# Altium schematic sheet TG21_TX_Xu ly ma tran phim.SchDoc
size A0; SheetNumber: 2; SheetTotal: 2
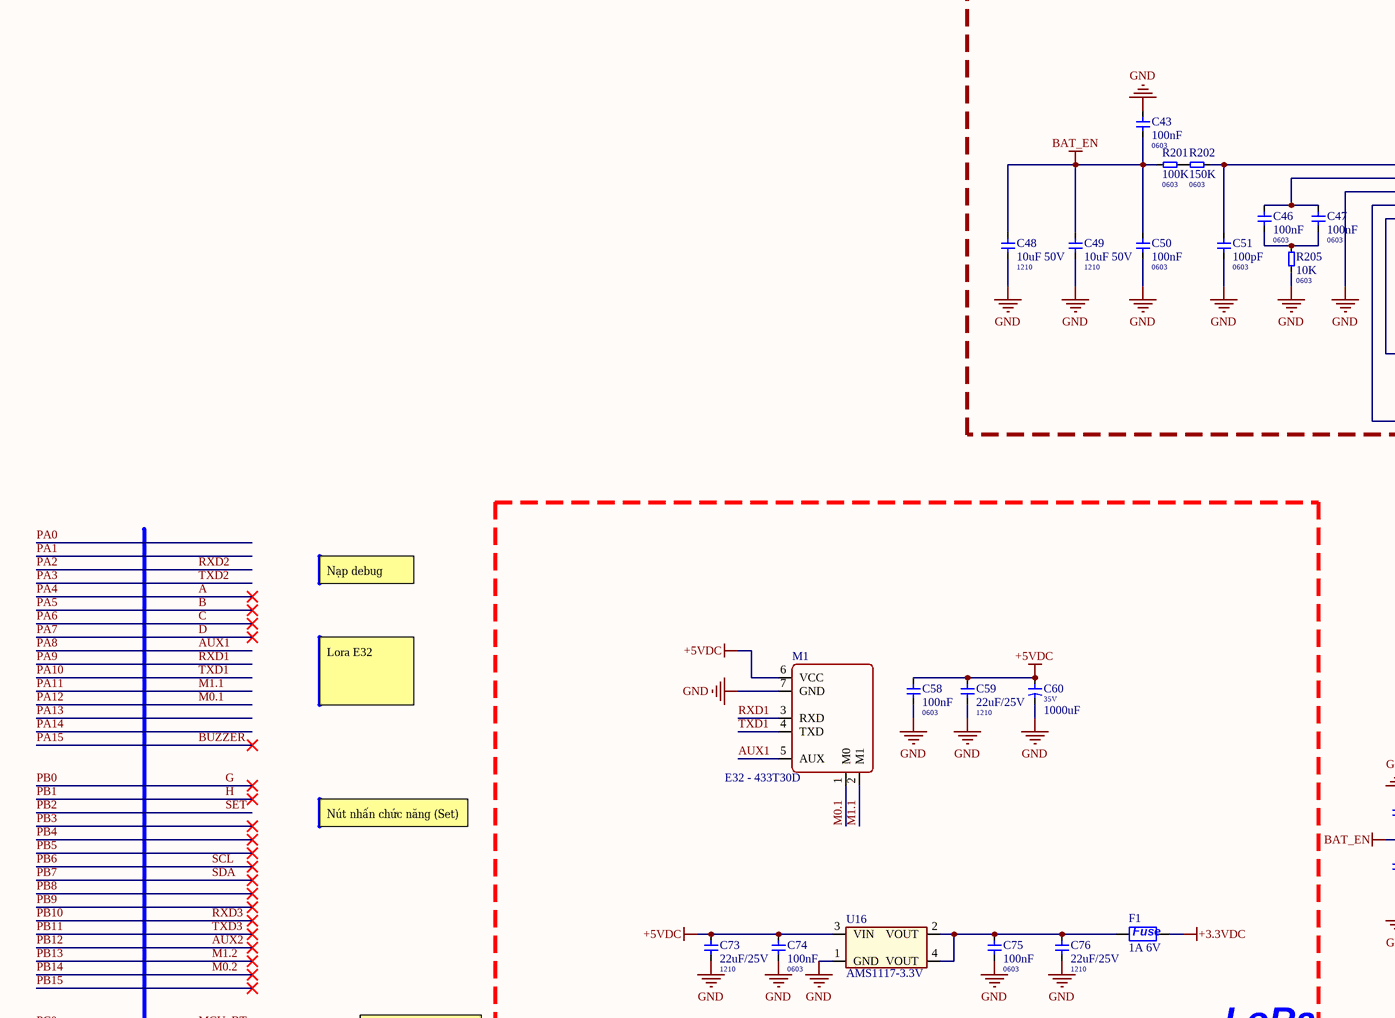
[diagram p0: TG21_TX_Xu ly ma tran phim.SchDoc, top left]
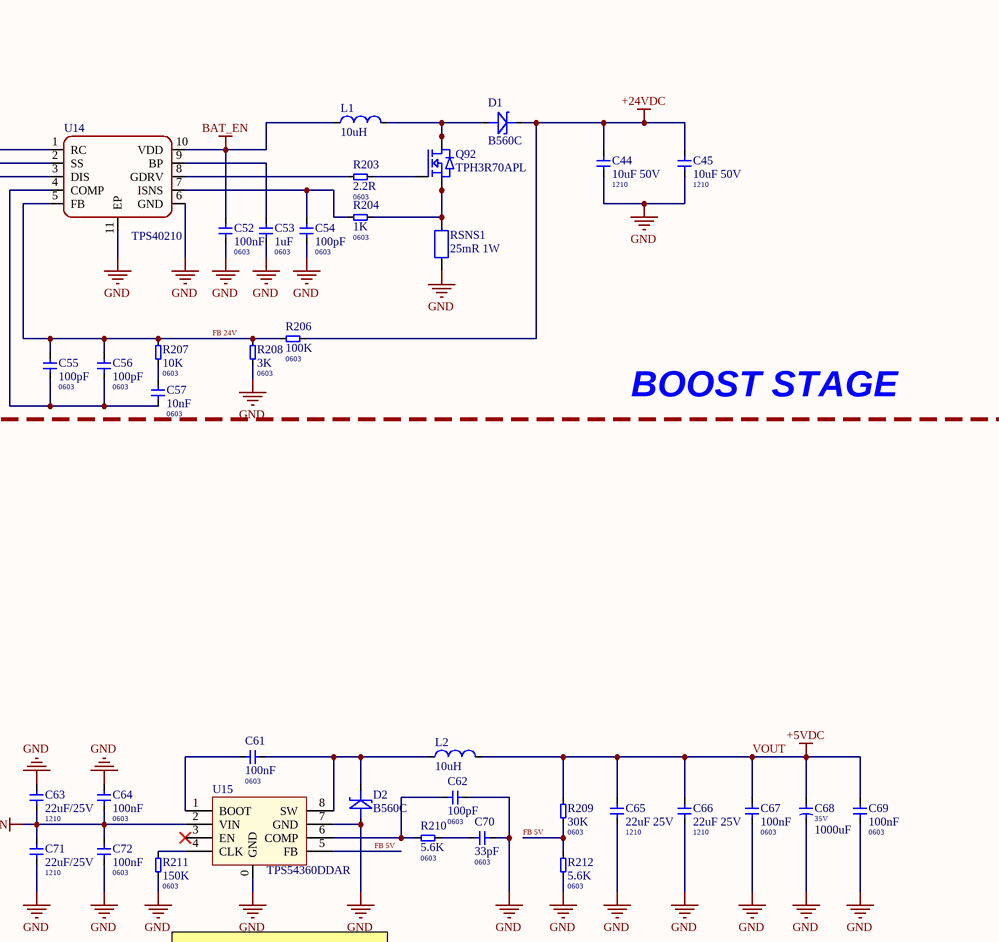
[diagram p1: TG21_TX_Xu ly ma tran phim.SchDoc, top right]
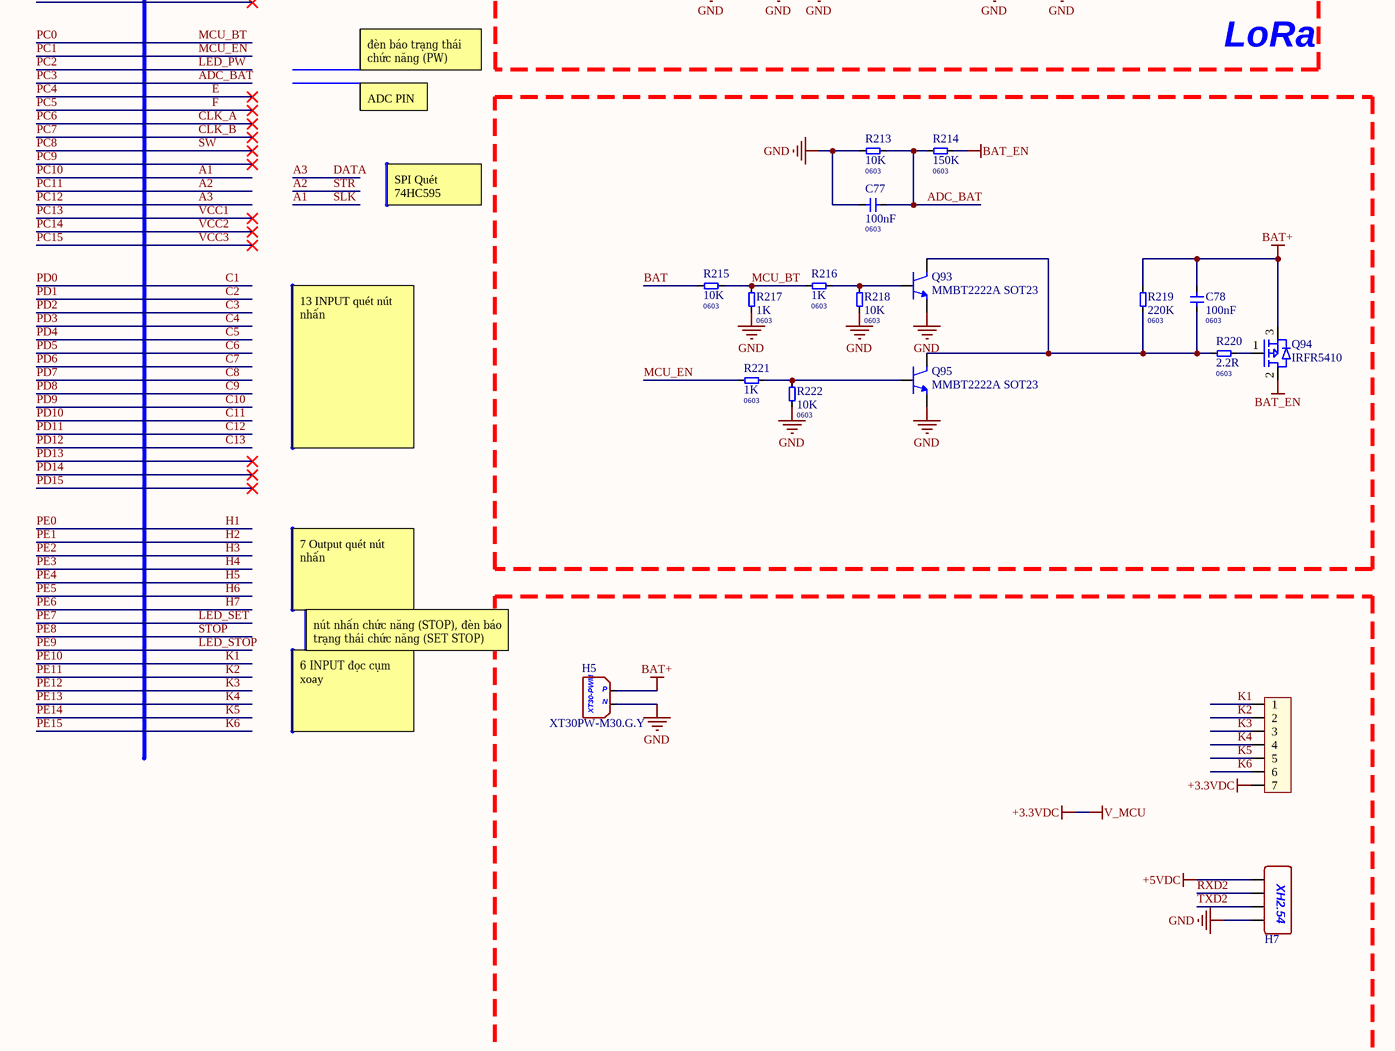
[diagram p2: TG21_TX_Xu ly ma tran phim.SchDoc, bottom left]
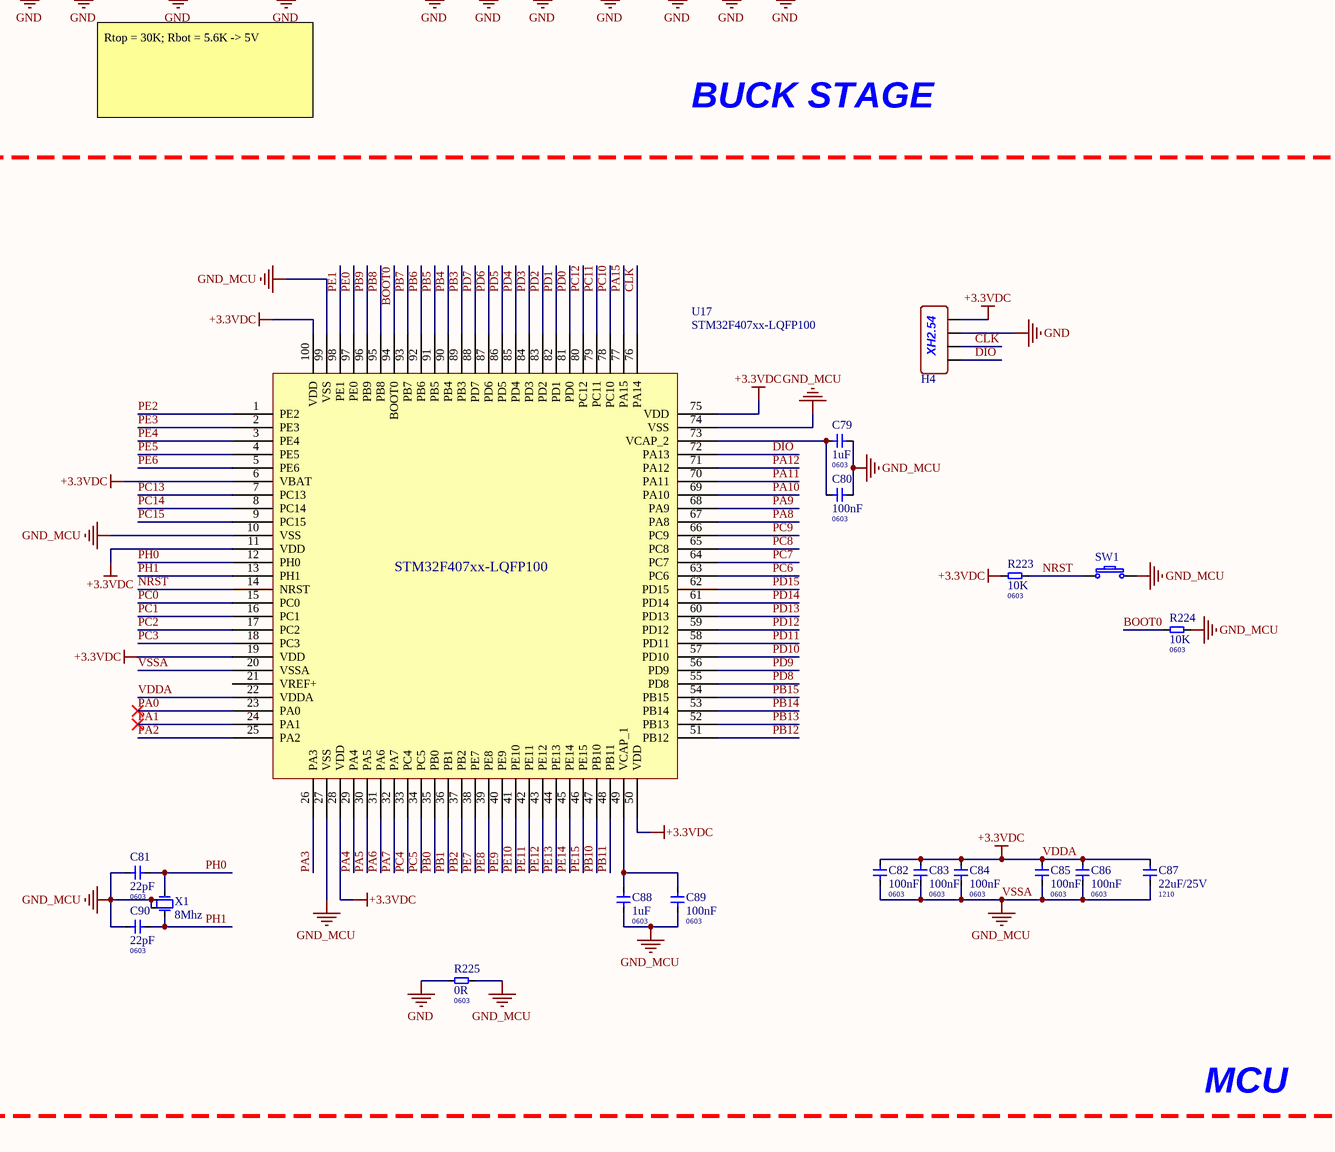
[diagram p3: TG21_TX_Xu ly ma tran phim.SchDoc, bottom right]

## Parts
C43  100nF  Package: 0603  [0603 MLCC]
C44  10uF 50V  Package: 1210  [1210 CAPACITOR]
C45  10uF 50V  Package: 1210  [1210 CAPACITOR]
C46  100nF  Package: 0603  [0603 MLCC]
C47  100nF  Package: 0603  [0603 MLCC]
C48  10uF 50V  Package: 1210  [1210 CAPACITOR]
C49  10uF 50V  Package: 1210  [1210 CAPACITOR]
C50  100nF  Package: 0603  [0603 MLCC]
C51  100pF  Package: 0603  [0603 MLCC]
C52  100nF  Package: 0603  [0603 MLCC]
C53  1uF  Package: 0603  [0603 MLCC]
C54  100pF  Package: 0603  [0603 MLCC]
C55  100pF  Package: 0603  [0603 MLCC]
C56  100pF  Package: 0603  [0603 MLCC]
C57  10nF  Package: 0603  [0603 MLCC]
C58  100nF  Package: 0603  [0603 MLCC]
C59  22uF/25V  Package: 1210  [1210 CAPACITOR]
C60  Voltage: 35V  Capacitor: 1000uF  [10x20 5.0 Capacitor]  (hidden comment: 1000uF/35V)
C61  100nF  Package: 0603  [0603 MLCC]
C62  100pF  Package: 0603  [0603 MLCC]
C63  22uF/25V  Package: 1210  [1210 CAPACITOR]
C64  100nF  Package: 0603  [0603 MLCC]
C65  22uF 25V  Package: 1210  [1210 CAPACITOR]
C66  22uF 25V  Package: 1210  [1210 CAPACITOR]
C67  100nF  Package: 0603  [0603 MLCC]
C68  Voltage: 35V  Capacitor: 1000uF  [10x20 5.0 Capacitor]  (hidden comment: 1000uF/35V)
C69  100nF  Package: 0603  [0603 MLCC]
C70  33pF  Package: 0603  [0603 MLCC]
C71  22uF/25V  Package: 1210  [1210 CAPACITOR]
C72  100nF  Package: 0603  [0603 MLCC]
C73  22uF/25V  Package: 1210  [1210 CAPACITOR]
C74  100nF  Package: 0603  [0603 MLCC]
C75  100nF  Package: 0603  [0603 MLCC]
C76  22uF/25V  Package: 1210  [1210 CAPACITOR]
C77  100nF  Package: 0603  [0603 MLCC]
C78  100nF  Package: 0603  [0603 MLCC]
C79  1uF  Package: 0603  [0603 MLCC]
C80  100nF  Package: 0603  [0603 MLCC]
C81  22pF  Package: 0603  [0603 MLCC]
C82  100nF  Package: 0603  [0603 MLCC]
C83  100nF  Package: 0603  [0603 MLCC]
C84  100nF  Package: 0603  [0603 MLCC]
C85  100nF  Package: 0603  [0603 MLCC]
C86  100nF  Package: 0603  [0603 MLCC]
C87  22uF/25V  Package: 1210  [1210 CAPACITOR]
C88  1uF  Package: 0603  [0603 MLCC]
C89  100nF  Package: 0603  [0603 MLCC]
C90  22pF  Package: 0603  [0603 MLCC]
D1  B560C  [SMC(DO-214AB)]
D2  B560C  [SMC(DO-214AB)]
F1  1A 6V  [1206 - Fuse]
H4  XY-XH2.54-4PZZ  [XH2.54 - 4PZZ]  (value not drawn)
H5  XT30PW-M30.G.Y  [XT30]
H6  Header 7P 2.54 Duc Thang  [XH2.54M-7]  (value not drawn)
H7  XY-XH2.54-4PZZ  [XH2.54 - 4PZZ]  (value not drawn)
L1  10uH  [12.2x12.2mm]
L2  10uH  [12.2x12.2mm]
M1  E32 - 433T30D  [E32 - 433T30D]
Q92  TPH3R70APL  [SOP Advanced]
Q93  MMBT2222A SOT23  [SOT23_HVT]
Q94  IRFR5410  [TO - 252]
Q95  MMBT2222A SOT23  [SOT23_HVT]
R201  100K  Package: 0603  [0603 Resistors]
R202  150K  Package: 0603  [0603 Resistors]
R203  2.2R  Package: 0603  [0603 Resistors]
R204  1K  Package: 0603  [0603 Resistors]
R205  10K  Package: 0603  [0603 Resistors]
R206  100K  Package: 0603  [0603 Resistors]
R207  10K  Package: 0603  [0603 Resistors]
R208  3K  Package: 0603  [0603 Resistors]
R209  30K  Package: 0603  [0603 Resistors]
R210  5.6K  Package: 0603  [0603 Resistors]
R211  150K  Package: 0603  [0603 Resistors]
R212  5.6K  Package: 0603  [0603 Resistors]
R213  10K  Package: 0603  [0603 Resistors]
R214  150K  Package: 0603  [0603 Resistors]
R215  10K  Package: 0603  [0603 Resistors]
R216  1K  Package: 0603  [0603 Resistors]
R217  1K  Package: 0603  [0603 Resistors]
R218  10K  Package: 0603  [0603 Resistors]
R219  220K  Package: 0603  [0603 Resistors]
R220  2.2R  Package: 0603  [0603 Resistors]
R221  1K  Package: 0603  [0603 Resistors]
R222  10K  Package: 0603  [0603 Resistors]
R223  10K  Package: 0603  [0603 Resistors]
R224  10K  Package: 0603  [0603 Resistors]
R225  0R  Package: 0603  [0603 Resistors]
RSNS1  25mR 1W  [1206 Resistor]
SW1  HX 3x6x2.5A-2.5N  [SW - 2P SMD]  (value not drawn)
U14  TPS40210  [MSOP 10]
U15  TPS54360DDAR  [SOIC8]
U16  AMS1117-3.3V  [SOT223 - 4P]
U17  STM32F407xx-LQFP100  [STM32_LQFP100]
X1  8Mhz  [5032 4P]

## Blocks framed on the sheet
BOOST STAGE: C43-C57 D1 L1 Q92 R201-R208 RSNS1 U14
LoRa: C58-C60 C73-C76 F1 M1 U16
MCU: C79-C90 H4 R223-R225 SW1 U17 X1

## Nets
+24VDC: C44.2 C45.2 D1.2(Kathode) R206.2
BAT+: C78.2 H5.1 Q94.3(S) R219.2
BAT_EN: C43.1 C48.2 C49.2 C50.1 C52.2 C63.1 C64.1 C71.1 C72.2 L1.1 Q94.2(D) R201.1 R214.2 U14.10(VDD) U15.2(VIN)
GND: C43.2 C44.1 C45.1 C48.1 C49.1 C50.2 C51.1 C52.1 C53.2 C54.1 C58.1 C59.1 C60.2 C62.1 C63.2 C64.2 C65.1 C66.1 C67.1 C68.2 C69.1 C70.1 C71.2 C72.1 C73.2 C74.1 C75.1 C76.2 C77.2 D2.1(Anode) H4.2 H5.2 H7.1 M1.7(GND) Q93.2(E) Q95.2(E) R205.1 R208.1 R211.1 R212.1 R213.2 R217.1 R218.1 R222.1 R225.1 RSNS1.1 U14.3(DIS) U14.6(GND) U14.11(EP) U15.0(GND) U15.7(GND) U16.1(GND)
VDDA: C82.2 C83.2 C84.2 C85.2 C86.2 C87.1 F1.2 H4.1 H6.7 R223.1 U17.6(VBAT) U17.11(VDD) U17.19(VDD) U17.22(VDDA) U17.28(VDD) U17.50(VDD) U17.75(VDD) U17.100(VDD)  [also labelled +3.3VDC, V_MCU]
VOUT: C58.2 C59.2 C60.1 C65.2 C66.2 C67.2 C68.1 C69.2 C73.1 C74.2 H7.4 L2.2 M1.6(VCC) R209.2 U16.3(VIN)  [also labelled +5VDC]
VSSA: C79.1 C80.1 C81.2 C82.1 C83.1 C84.1 C85.1 C86.1 C87.2 C88.1 C89.1 C90.2 R224.1 R225.2 SW1.2 U17.10(VSS) U17.20(VSSA) U17.27(VSS) U17.74(VSS) U17.99(VSS) X1.2 X1.4  [also labelled GND_MCU]
A: U17.29(PA4)  [also labelled PA4]
A1: U17.78(PC10)  [also labelled PC10, SLK]
A2: U17.79(PC11)  [also labelled PC11, STR]
A3: U17.80(PC12)  [also labelled DATA, PC12]
ADC_BAT: C77.1 R213.1 R214.1 U17.18(PC3)  [also labelled PC3]
AUX1: M1.5(AUX) U17.67(PA8)  [also labelled PA8]
AUX2: U17.51(PB12)  [also labelled PB12]
B: U17.30(PA5)  [also labelled PA5]
BAT: R215.1
BOOT0: R224.2 U17.94(BOOT0)
BUZZER: U17.77(PA15)  [also labelled PA15]
C: U17.31(PA6)  [also labelled PA6]
C1: U17.81(PD0)  [also labelled PD0]
C2: U17.82(PD1)  [also labelled PD1]
C3: U17.83(PD2)  [also labelled PD2]
C4: U17.84(PD3)  [also labelled PD3]
C5: U17.85(PD4)  [also labelled PD4]
C6: U17.86(PD5)  [also labelled PD5]
C7: U17.87(PD6)  [also labelled PD6]
C8: U17.88(PD7)  [also labelled PD7]
C9: U17.55(PD8)  [also labelled PD8]
C10: U17.56(PD9)  [also labelled PD9]
C11: U17.57(PD10)  [also labelled PD10]
C12: U17.58(PD11)  [also labelled PD11]
C13: U17.59(PD12)  [also labelled PD12]
CLK: H4.3 U17.76(PA14)
CLK_A: U17.63(PC6)  [also labelled PC6]
CLK_B: U17.64(PC7)  [also labelled PC7]
D: U17.32(PA7)  [also labelled PA7]
DIO: H4.4 U17.72(PA13)
E: U17.33(PC4)  [also labelled PC4]
F: U17.34(PC5)  [also labelled PC5]
FB 5V: R209.1 R212.2 U15.5(FB)
FB 24V: C55.2 C56.2 R206.1 R207.2 R208.2 U14.5(FB)
G: U17.35(PB0)  [also labelled PB0]
H: U17.36(PB1)  [also labelled PB1]
H1: U17.97(PE0)  [also labelled PE0]
H2: U17.98(PE1)  [also labelled PE1]
H3: U17.1(PE2)  [also labelled PE2]
H4: U17.2(PE3)  [also labelled PE3]
H5: U17.3(PE4)  [also labelled PE4]
H6: U17.4(PE5)  [also labelled PE5]
H7: U17.5(PE6)  [also labelled PE6]
K1: H6.1 U17.41(PE10)  [also labelled PE10]
K2: H6.2 U17.42(PE11)  [also labelled PE11]
K3: H6.3 U17.43(PE12)  [also labelled PE12]
K4: H6.4 U17.44(PE13)  [also labelled PE13]
K5: H6.5 U17.45(PE14)  [also labelled PE14]
K6: H6.6 U17.46(PE15)  [also labelled PE15]
LED_PW: U17.17(PC2)  [also labelled PC2]
LED_SET: U17.38(PE7)  [also labelled PE7]
LED_STOP: U17.40(PE9)  [also labelled PE9]
M0.1: M1.1(M0) U17.71(PA12)  [also labelled PA12]
M0.2: U17.53(PB14)  [also labelled PB14]
M1.1: M1.2(M1) U17.70(PA11)  [also labelled PA11]
M1.2: U17.52(PB13)  [also labelled PB13]
MCU_BT: R215.2 R216.2 R217.2 U17.15(PC0)  [also labelled PC0]
MCU_EN: R221.2 U17.16(PC1)  [also labelled PC1]
NRST: R223.2 SW1.1 U17.14(NRST)
PA0: U17.23(PA0)
PA1: U17.24(PA1)
PA2: H7.3 U17.25(PA2)  [also labelled RXD2]
PA3: H7.2 U17.26(PA3)  [also labelled TXD2]
PA9: M1.3(RXD) U17.68(PA9)  [also labelled RXD1]
PA10: M1.4(TXD) U17.69(PA10)  [also labelled TXD1]
PB2: U17.37(PB2)  [also labelled SET]
PB3: U17.89(PB3)
PB4: U17.90(PB4)
PB5: U17.91(PB5)
PB6: U17.92(PB6)  [also labelled SCL]
PB7: U17.93(PB7)  [also labelled SDA]
PB8: U17.95(PB8)
PB9: U17.96(PB9)
PB10: U17.47(PB10)  [also labelled RXD3]
PB11: U17.48(PB11)  [also labelled TXD3]
PB15: U17.54(PB15)
PC8: U17.65(PC8)  [also labelled SW]
PC9: U17.66(PC9)
PC13: U17.7(PC13)  [also labelled VCC1]
PC14: U17.8(PC14)  [also labelled VCC2]
PC15: U17.9(PC15)  [also labelled VCC3]
PD13: U17.60(PD13)
PD14: U17.61(PD14)
PD15: U17.62(PD15)
PE8: U17.39(PE8)  [also labelled STOP]
PH0: C81.1 U17.12(PH0) X1.3
PH1: C90.1 U17.13(PH1) X1.1
NetC46_1: C46.1 C47.1 U14.2(SS)
NetC46_2: C46.2 C47.2 R205.2
NetC51_2: C51.2 R202.2 U14.1(RC)
NetC53_1: C53.1 U14.9(BP)
NetC54_2: C54.2 R204.1 U14.7(ISNS)
NetC55_1: C55.1 C56.1 C57.1 U14.4(COMP)
NetC57_2: C57.2 R207.1
NetC61_1: C61.1 D2.2(Kathode) L2.1 U15.8(SW)
NetC61_2: C61.2 U15.1(BOOT)
NetC62_2: C62.2 R210.1 U15.6(COMP)
NetC70_2: C70.2 R210.2
NetC75_2: C75.2 C76.1 F1.1 U16.2(VOUT) U16.4(VOUT)
NetC78_1: C78.1 Q93.3(C) Q95.3(C) R219.1 R220.2
NetC79_2: C79.2 C80.2 U17.73(VCAP_2)
NetC88_2: C88.2 C89.2 U17.49(VCAP_1)
NetD1_1: D1.1(Anode) L1.2 Q92.5(D) Q92.6(D) Q92.7(D) Q92.8(D) Q92.TAB(D)
NetQ92_1: Q92.1(S) Q92.2(S) Q92.3(S) R204.2 RSNS1.2
NetQ92_4: Q92.4(G) R203.2
NetQ93_1: Q93.1(B) R216.1 R218.2
NetQ94_1: Q94.1(G) R220.1
NetQ95_1: Q95.1(B) R221.1 R222.2
NetR201_2: R201.2 R202.1
NetR203_1: R203.1 U14.8(GDRV)
NetR211_2: R211.2 U15.4(CLK)

Not connected (* = marked no-connect by the designer): U15 3(EN)*; U17 21(VREF+)

## Notes on the sheet
- Nạp debug
- Lora E32
- Nút nhấn chức năng (Set)
- đèn báo trạng thái chức năng (PW)
- Rtop = 30K; Rbot = 5.6K -> 5V
- BUCK STAGE
- ADC PIN
- SPI Quét 74HC595
- 13 INPUT quét nút nhấn
- 7 Output quét nút nhấn
- nút nhấn chức năng (STOP), đèn báo trạng thái chức năng (SET STOP)
- 6 INPUT đọc cụm xoay
- (in symbol XH2.54 4PZZ) XH2.54
- (in symbol XT30PW-M30.G.Y) P; N; XT30-PWM

## Library data of the parts
C43 C46 C47 C50 C52 C58 C61 C64 C67 C69 C72 C74 C75 C77 C78 C80 C82-C86 C89 = 0603 100nF: 100nF ±10% 50V Ceramic Capacitor X7R 0603; Manufacturer: YAGEO; Mfr. Part #: CC0603KRX7R9BB104; LCSC Part #: C14663; ComponentLink1Description: LCSC Link; ComponentLink1URL: https://www.lcsc.com/product-detail/C14663.html?s_z=n_0603%2520100nF
C44 C45 C48 C49 = 1210 10uF 50V: 10uF ±10% 50V Ceramic Capacitor X7R 1210; Manufacturer: Samsung Electro-Mechanics; Mfr. Part #: CL32B106KBJNNNE; LCSC Part #: C138687; ComponentLink1Description: LCSC Link; ComponentLink1URL: https://www.lcsc.com/product-detail/C138687.html?s_z=n_1210%252010uF
C51 C54-C56 C62 = 0603 100pF: 100pF ±5% 50V Ceramic Capacitor C0G 0603; Manufacturer: Samsung Electro-Mechanics; Mfr. Part #: CL10C101JB8NNNC; LCSC Part #: C14858; ComponentLink1Description: LCSC Link; ComponentLink1URL: https://www.lcsc.com/product-detail/C14858.html?s_z=n_100pF%25200603&spm=wm.ssy.bg.0.xh&lcsc_vid=FVcIBVBRElIPBFdUFgBYX10HEQJbUQVVQANfV1wFQQcxVlNRQ1RWV1NSQ1dXXjsOAxUeFF5JWBYZEEoKFBINSQcJGk4eFQsCAgIaSgADAwAHC0slRVheUFRSQU8GEwkK
C53 C79 C88 = 0603 1uF: 1uF ±10% 50V Ceramic Capacitor X5R 0603; Manufacturer: Samsung Electro-Mechanics; Mfr. Part #: CL10A105KB8NNNC; LCSC Part #: C15849; ComponentLink1Description: LCSC Link; ComponentLink1URL: https://www.lcsc.com/product-detail/C15849.html?s_z=n_1uF%25200603%25201%2525&spm=wm.ssy.bg.0.xh&lcsc_vid=FVcIBVBRElIPBFdUFgBYX10HEQJbUQVVQANfV1wFQQcxVlNRQlFeXlNXT1hdUDsOAxUeFF5JWBYZEEoKFBINSQcJGk4%3D
C57 = 0603 10nF: 10nF ±10% 50V Ceramic Capacitor X7R 0603; Manufacturer: YAGEO; Mfr. Part #: CC0603KRX7R9BB103; LCSC Part #: C100042; ComponentLink1Description: LCSC Link; ComponentLink1URL: https://www.lcsc.com/product-detail/C100042.html?s_z=n_0603%252010nF&spm=wm.ssy.bg.0.xh&lcsc_vid=FVcIBVBRElIPBFdUFgBYX10HEQJbUQVVQANfV1wFQQcxVlNRQlFfVVBSRVNYXjsOAxUeFF5JWBYZEEoKFBINSQcJGk4eFQsCAgIaSgADAwAHC0slRFFaV1JQWQkaCgg%3D
C59 C63 C71 C73 C76 C87 = 1210 22uF 25V X7R: 22uF ±10% 25V Ceramic Capacitor X7R 1210; Manufacturer: Samsung Electro-Mechanics; Mfr. Part #: CL32B226KAJNNNE; LCSC Part #: C309062; ComponentLink1Description: LCSC Link; ComponentLink1URL: https://www.lcsc.com/product-detail/C309062.html?s_z=n_22uF%25201210
C60 C68 = 10x20 1000uF 35V: 1000uF 35V Aluminum Electrolytic Capacitors Through Hole,D10xL20mm 2000hrs@105℃; Manufacturer: Rubycon; Mfr. Part #: 35PX1000MEFC10X20; LCSC Part #: C136014; ComponentLink1Description: LCSC Link; ComponentLink1URL: https://www.lcsc.com/product-detail/C136014.html?s_z=n_35V%25201000uF%2520rubycon; Package: Through Hole,D10xL20mm; Type: Capacitor; Assembly Type: DIP Assembly
C65 C66 = 1210 22uF 25V: 22uF ±10% 25V Ceramic Capacitor X7R 1210; Manufacturer: Samsung Electro-Mechanics; Mfr. Part #: CL32B226KAJNNNE; LCSC Part #: C309062; ComponentLink1Description: LCSC Link; ComponentLink1URL: https://www.lcsc.com/product-detail/C309062.html?s_z=n_22uF%25201210
C70 = 0603 33pF: 33pF ±5% 50V Ceramic Capacitor NP0 0603; Manufacturer: YAGEO; Mfr. Part #: CC0603JRNPO9BN330; LCSC Part #: C107047; ComponentLink1Description: LCSC Link; ComponentLink1URL: https://www.lcsc.com/product-detail/C107047.html?s_z=n_33pF%25200603&spm=wm.ssy.bg.0.xh&lcsc_vid=FVcIBVBRElIPBFdUFgBYX10HEQJbUQVVQANfV1wFQQcxVlNRQ1RWV1xeR1ZZUTsOAxUeFF5JWBYZEEoKFBINSQcJGk4dAgUUFAk%3D
C81 C90 = 0603 22pF: 22pF ±5% 50V Ceramic Capacitor C0G 0603; Manufacturer: Samsung Electro-Mechanics; Mfr. Part #: CL10C220JB8NNNC; LCSC Part #: C1653; ComponentLink1Description: LCSC Link; ComponentLink1URL: https://www.lcsc.com/product-detail/C1653.html?s_z=n_22pF%252050V%25200603
D1 D2 = B560C - 13- F: Voltage： 60V Current： 5A; Manufacturer: DIODES; Mfr. Part #: B560C-13-F; LCSC Part #: C85100; Package: SMC(DO-214AB); ComponentLink1Description: LCSC Link; ComponentLink1URL: https://www.lcsc.com/product-detail/C85100.html?s_z=n_B560C
F1 = 1206 Fuse 1A 6V: Polymeric PTC Resettable Fuse 6V 1A Surface Mount 1206; Manufacturer: BHFUSE; Mfr. Part #: BSMD1206-100-6V; LCSC Part #: C883129; Package: 1206; ComponentLink1Description: LCSC Link; ComponentLink1URL: https://www.lcsc.com/product-detail/C883129.html?s_z=n_q_Resettable%2520Fuse%25206V%25201A%25201206&spm=wm.fly.bg.0.xh&lcsc_vid=QQBdBlYAQFFWUgBXTlUPAgFQQQIIBQIHEQIPAgJRQFAxVlNRT1daVVdeT1JfUzsOAxUeFF5JWBYZEEoKFBINSQcJGk4NBhADEA4cHktXRVZADxALGw%3D%3D; ComponentLink2Description: Datasheet; ComponentLink2URL: NO; Type: Fuse; Assembly Type: SMT Assembly
H4 H7 = XH2.54 4PZZ: XH 1 4P -25℃~+85℃ 2.54mm 4 2A 250V 1x4P Through Hole,P=2.54mm Headers, Male Pins RoHS; Manufacturer: XYECONN; Mfr. Part #: XY-XH2.54-4PZZ; LCSC Part #: C53201003; ComponentLink1Description: LCSC Link; ComponentLink1URL: https://www.lcsc.com/product-detail/C53201003.html?s_z=n_XH2.54%25204P; Package: Through Hole,P=2.54mm; Type: Header; Assembly Type: DIP Assembly; ComponentLink2Description: Datasheet; ComponentLink2URL: https://www.lcsc.com/datasheet/C53201003.pdf
H5 = XT30PW-M30.G.Y: AMASS XT30PW-M30.G.Y; Manufacturer: Changzhou Amass Elec; Mfr. Part #: XT30PW-M30.G.Y; LCSC Part #: C431092; ComponentLink1Description: LCSC Link; ComponentLink1URL: https://www.lcsc.com/product-detail/C431092.html?s_z=n_q_xt30pw&spm=wm.fly.bg.0.xh&lcsc_vid=QQBdBlYAQFFWUgBXTlUPAgFQQQIIBQIHEQIPAgJRQFAxVlNRT1ddX1xWQlNaUzsOAxUeFF5JWBYZEEoKFBINSQcJGk4eFQsCAgIaSgADAwAHC0slQllfX11TQk8GEwkK; ComponentLink2Description: Datasheet; ComponentLink2URL: https://www.lcsc.com/datasheet/C431092.pdf?spm=wm.sxq.inf.ggs___wm.fly.bg.0.xh&lcsc_vid=QQBdBlYAQFFWUgBXTlUPAgFQQQIIBQIHEQIPAgJRQFAxVlNRT1ddX1xWQlNaUzsOAxUeFF5JWBYZEEoKFBINSQcJGk4eFQsCAgIaSgADAwAHC0slQllfX11TQk8GEwkK; Type: Connector/Header; Assembly Type: DIP Assembly; Value: XT30PW-M30.G.Y
H6 = Header 7P 2.54 Duc Thang: Cắm; Ten_Linh_Kien: Header 7P XH2.54-7P Đực Thẳng; Don_Vi: Con; Ma_Hang: MH003369; Chung_Loai: Cắm
L1 L2 = CDRH127N 10uH: 5.4A 10uH 21.6mΩ ±20% SMD,12.2x12.2mm Fixed Inductors RoHS; Manufacturer: MINGSTAR; Mfr. Part #: CDRH127N-100M; LCSC Part #: C2832085; Package: SMD,12.2x12.2mm; ComponentLink1Description: LCSC Link; ComponentLink1URL: http://lcsc.com/product-detail/C2832085.html?s_z=n_CDRH127
M1 = E32 - 433T30D: 8km UART Through Hole RF Transceiver Modules and Modems RoHS; Manufacturer: EBYTE; Mfr. Part #: E32-433T30D; LCSC Part #: C97351; Package: Through Hole; Type: Module; ComponentLink1Description: LCSC Link; ComponentLink1URL: https://www.lcsc.com/product-detail/C97351.html?s_z=n_E32%2520433T30D; ComponentLink2Description: Datasheet; ComponentLink2URL: https://www.lcsc.com/datasheet/C97351.pdf
Q92 = TPH3R70: Manufacturer: TOSHIBA; Mfr. Part #: TPH3R70APL; LCSC Part #: C556308; Package: SO-8; ComponentLink1Description: LCSC Link; ComponentLink1URL: https://www.lcsc.com/product-detail/C556308.html?s_z=n_tph3R70
Q93 Q95 = MMBT2222A: Bipolar (BJT) Transistor NPN 20V 350mA 300MHz 300mW Surface Mount SOT-23; Manufacturer: JSMSEMI; Mfr. Part #: MMBT2222A; LCSC Part #: C916372; Package: SOT-23; ComponentLink1Description: LCSC Link; ComponentLink1URL: https://www.lcsc.com/product-detail/C916372.html?s_z=n_mmbt222&spm=wm.ssy.bg.4.xh&lcsc_vid=FVcIBVBRElIPBFdUFgBYX10HEQJbUQVVQANfV1wFQQcxVlNRQ1hYVFJVRlldXjsOAxUeFF5JWBYZEEoKFBINSQcJGk4dAgUUFAk%3D
Q94 = IRFR5410TRPBF: P-Channel 100V 13A 66W Surface Mount DPAK(TO-252AA); Manufacturer: Infineon; Mfr. Part #: IRFR5410TRPBF; LCSC Part #: C3018; Package: DPAK(TO-252AA); ComponentLink1Description: LCSC Link; ComponentLink1URL: https://www.lcsc.com/product-detail/C3018.html?s_z=n_IRFR5410TRPBF
R201 R206 = 0603 100K: 100mW 100KΩ 75V Thick Film Resistor ±1% ±100ppm/℃ 0603 Chip Resistor - Surface Mount RoHS; Mfr. Part #: FRC0603F1003TS; Manufacturer: FOJAN; LCSC Part #: C2906980; ComponentLink1Description: LCSC Link; ComponentLink1URL: https://www.lcsc.com/product-detail/C2906980.html?s_z=n_0603%25201%2525%2520100K; Value: 100K
R202 R211 R214 = 0603 150K: 100mW 150KΩ 75V Thick Film Resistor ±1% ±100ppm/℃ 0603 Chip Resistor - Surface Mount RoHS; Mfr. Part #: 0603WAF1503T5E; Manufacturer: UNI-ROYAL; LCSC Part #: C22807; ComponentLink1Description: LCSC Link; ComponentLink1URL: https://www.lcsc.com/product-detail/C22807.html?s_z=n_0603%25201%2525%2520150K; Value: 150K
R203 R220 = 0603 2.2R: 100mW 2.2Ω 75V Thick Film Resistor ±1% ±100ppm/℃ 0603 Chip Resistor - Surface Mount RoHS; Mfr. Part #: FRC0805F2R20TS; Manufacturer: FOJAN; LCSC Part #: C2933402; ComponentLink1Description: LCSC Link; ComponentLink1URL: https://www.lcsc.com/product-detail/C2933402.html?s_z=n_2.2R%25201%2525&spm=wm.ssy.bg.6.xh&lcsc_vid=FVcIBVBRElIPBFdUFgBYX10HEQJbUQVVQANfV1wFQQcxVlNRQ1hYUFNVRlVWUzsOAxUeFF5JWBYZEEoKFBINSQcJGk4dAgUUFAk%3D; Value: 2.2R
R204 R216 R217 R221 = 0603 1K: 100mW 1kΩ 75V Thick Film Resistor ±1% ±100ppm/℃ 0603 Chip Resistor - Surface Mount RoHS; Mfr. Part #: CRCW06031K00FKEA; Manufacturer: VISHAY; LCSC Part #: C844920; ComponentLink1Description: LCSC Link; ComponentLink1URL: https://www.lcsc.com/product-detail/C844920.html?s_z=n_0603%25201K; Value: 1K
R205 R207 R213 R215 R218 R222-R224 = 0603 10K: 100mW 10kΩ 75V Thick Film Resistor ±1% ±100ppm/℃ 0603 Chip Resistor - Surface Mount RoHS; Manufacturer: VISHAY; Mfr. Part #: CRCW060310K0FKEA; LCSC Part #: C844918; ComponentLink1Description: LCSC Link; ComponentLink1URL: https://www.lcsc.com/product-detail/C844918.html?s_z=n_10K
R208 = 0603 3K: 3kΩ ±1% 100mW 0603 Thick Film Resistor; Mfr. Part #: 0805W8F7503T5E; Manufacturer: UNI-ROYAL; LCSC Part #: C17817; ComponentLink1Description: LCSC Link; ComponentLink1URL: https://www.lcsc.com/product-detail/C2907033.html?s_z=n_3K%25201%2525%25200603&spm=wm.ssy.bg.0.xh&lcsc_vid=FVcIBVBRElIPBFdUFgBYX10HEQJbUQVVQANfV1wFQQcxVlNRQVBYUlZWRlRaUjsOAxUeFF5JWBYZEEoKFBINSQcJGk4dAgUUFAk%3D; ComponentLink2Description: Datasheet; ComponentLink2URL: https://www.lcsc.com/datasheet/C2907033.pdf?spm=wm.sxq.inf.ggs___wm.ssy.bg.0.xh&lcsc_vid=FVcIBVBRElIPBFdUFgBYX10HEQJbUQVVQANfV1wFQQcxVlNRQVBYUlZWRlRaUjsOAxUeFF5JWBYZEEoKFBINSQcJGk4dAgUUFAk%3D; Type: Resistor; Assembly Type: SMT Assembly; Value: 3K
R209 = 0603 30K: 30kΩ ±1% 100mW 0603 Thick Film Resistor; Mfr. Part #: FRC0603F3002TS; Manufacturer: FOJAN; LCSC Part #: C2907025; ComponentLink1Description: LCSC Link; ComponentLink1URL: https://www.lcsc.com/product-detail/C2907025.html?s_z=n_q_t_0603%252030K&spm=wm.fly.bg.0.xh___wm.ssy.tc.0.tz&lcsc_vid=QQBdBlYAQFFWUgBXTlUPAgFQQQIIBQIHEQIPAgJRQFAxVlNRT1daV1JVTlhbUzsOAxUeFF5JWBYZEEoKFBINSQcJGk4dAgUUFAk%3D; ComponentLink2Description: Datasheet; ComponentLink2URL: https://www.lcsc.com/datasheet/C2907025.pdf?spm=wm.sxq.inf.ggs___wm.fly.bg.0.xh&lcsc_vid=QQBdBlYAQFFWUgBXTlUPAgFQQQIIBQIHEQIPAgJRQFAxVlNRT1daV1JVTlhbUzsOAxUeFF5JWBYZEEoKFBINSQcJGk4dAgUUFAk%3D; Type: Resistor; Assembly Type: SMT Assembly; Value: 30K
R210 = 0603 5.6K: 100mW 5.6KΩ 75V Thick Film Resistor ±1% ±100ppm/℃ 0603 Chip Resistor - Surface Mount RoHS; Mfr. Part #: FRC0603F5601TS; Manufacturer: FOJAN; Value: 5.1K; LCSC Part #: C2907046; ComponentLink1Description: LCSC Link; ComponentLink1URL: https://www.lcsc.com/product-detail/C2907046.html?s_z=n_5.6K%25200603&spm=wm.ssy.bg.0.xh&lcsc_vid=FVcIBVBRElIPBFdUFgBYX10HEQJbUQVVQANfV1wFQQcxVlNRQ1RWV1FeQVlfVDsOAxUeFF5JWBYZEEoKFBINSQcJGk4eFQsCAgIaSgADAwAHC0slQ1VdUFNIHxUDCw%3D%3D
R212 = 0603 5.6K: 100mW 5.6KΩ 75V Thick Film Resistor ±1% ±100ppm/℃ 0603 Chip Resistor - Surface Mount RoHS; Mfr. Part #: FRC0603F5601TS; Manufacturer: FOJAN; LCSC Part #: C2907046; ComponentLink1Description: LCSC Link; ComponentLink1URL: https://www.lcsc.com/product-detail/C2907046.html?s_z=n_5.6K%25200603&spm=wm.ssy.bg.0.xh&lcsc_vid=FVcIBVBRElIPBFdUFgBYX10HEQJbUQVVQANfV1wFQQcxVlNRQ1RWV1FeQVlfVDsOAxUeFF5JWBYZEEoKFBINSQcJGk4eFQsCAgIaSgADAwAHC0slQ1VdUFNIHxUDCw%3D%3D; Value: 5.6K
R219 = 0603 220K: 100mW 220KΩ 75V Thick Film Resistor ±1% ±100ppm/℃ 0603 Chip Resistor - Surface Mount RoHS; Mfr. Part #: FRC0603F2203TS; Manufacturer: FOJAN; LCSC Part #: C2907013; ComponentLink1Description: LCSC Link; ComponentLink1URL: https://www.lcsc.com/product-detail/C2907013.html?s_z=n_0603%25201%2525%2520220K; Value: 220K
R225 = 0603 0R: 100mW 0Ω 75V Thick Film Resistor ±1% ±100ppm/℃ 0603 Chip Resistor - Surface Mount RoHS; Mfr. Part #: RC0603FR-070RL; Manufacturer: YAGEO; LCSC Part #: C100044; ComponentLink1Description: LCSC Link; ComponentLink1URL: https://www.lcsc.com/product-detail/C100044.html?s_z=n_0R%25201%2525%25200603&spm=wm.ssy.bg.1.xh&lcsc_vid=FVcIBVBRElIPBFdUFgBYX10HEQJbUQVVQANfV1wFQQcxVlNRQ1RWVFVVRFVbUzsOAxUeFF5JWBYZEEoKFBINSQcJGk4dAgUUFAk%3D; Value: 0R
RSNS1 = 1206 25mR: 1W 25mΩ ±50ppm/℃ ±1% 1206 Chip Resistor - Surface Mount RoHS; Manufacturer: JIERR; Mfr. Part #: JER1206F1R025; LCSC Part #: C46634441; Package: 1206; ComponentLink1Description: LCSC Link; ComponentLink1URL: https://www.lcsc.com/product-detail/C46634441.html?s_z=n_25mR%25201W&spm=wm.ssy.bg.1.stp&lcsc_vid=FVcIBVBRElIPBFdUFgBYX10HEQJbUQVVQANfV1wFQQcxVlNRQVBYVlFWT1lXVzsOAxUeFF5JWBYZEEoKFBINSQcJGk4eFQsCAgIaSgADAwAHC0slRlVZVVxIHxUDCw%3D%3D; ComponentLink2Description: Datasheet; ComponentLink2URL: https://www.lcsc.com/datasheet/C46634441.pdf?spm=wm.sxq.inf.ggs___wm.ssy.bg.1.stp&lcsc_vid=FVcIBVBRElIPBFdUFgBYX10HEQJbUQVVQANfV1wFQQcxVlNRQVBYVlFWT1lXVzsOAxUeFF5JWBYZEEoKFBINSQcJGk4eFQsCAgIaSgADAwAHC0slRlVZVVxIHxUDCw%3D%3D
SW1 = Switch Tactile 3x6x2.5: Tactile Switch SPST 250gf 2.5mm SMD (SMT) Tab 6mm x 3.6mm Surface Mount; Manufacturer: hanxia; Mfr. Part #: HX 3x6x2.5A-2.5N; LCSC Part #: C36498960; Package: SMD,6x3mm; ComponentLink1Description: LCSC Link; ComponentLink1URL: https://www.lcsc.com/product-detail/C36498960.html?s_z=n_q_p_3x6x2.5&spm=wm.ssy.bg.0.xh&lcsc_vid=QQBdBlYAQFFWUgBXTlUPAgFQQQIIBQIHEQIPAgJRQFAxVlNRT1daU1NWQVBbVTsOAxUeFF5JWBYZEEoKFBINSQcJGk4NBhADEA4cHktXRVZADxALGw%3D%3D; ComponentLink2Description: Datasheet; ComponentLink2URL: https://www.lcsc.com/datasheet/C36498960.pdf?spm=wm.sxq.inf.ggs___wm.ssy.bg.0.xh&lcsc_vid=QQBdBlYAQFFWUgBXTlUPAgFQQQIIBQIHEQIPAgJRQFAxVlNRT1daU1NWQVBbVTsOAxUeFF5JWBYZEEoKFBINSQcJGk4NBhADEA4cHktXRVZADxALGw%3D%3D; Type: Switch; Assembly Type: SMT Assembly
U14 = TPS40210DGQR: 1 MSOP-10-EP DC DC Switching Controllers RoHS; Manufacturer: TI; Mfr. Part #: TPS40210DGQR; LCSC Part #: C14728; Package: MSOP-10-EP; ComponentLink1Description: LCSC Link; ComponentLink1URL: https://www.lcsc.com/product-detail/C14728.html?s_z=n_TPS40210&spm=wm.ssy.bg.0.xh&lcsc_vid=FVcIBVBRElIPBFdUFgBYX10HEQJbUQVVQANfV1wFQQcxVlNRQVBbX1FeRllYUDsOAxUeFF5JWBYZEEoKFBINSQcJGk4dAgUUFAk%3D; Type: IC; Assembly Type: SMT Assembly; ComponentLink2Description: Datasheet; ComponentLink2URL: https://www.lcsc.com/datasheet/C14728.pdf?spm=wm.sxq.inf.ggs___wm.ssy.bg.0.xh&lcsc_vid=FVcIBVBRElIPBFdUFgBYX10HEQJbUQVVQANfV1wFQQcxVlNRQVBbX1FeRllYUDsOAxUeFF5JWBYZEEoKFBINSQcJGk4dAgUUFAk%3D
U15 = TPS54360: 60V Input, 3.5A Output Step-Down DC-DC Converter; Manufacturer: TI; Mfr. Part #: TPS54360DDAR; LCSC Part #: C44377; Package: SOIC-8-EP; ComponentLink1Description: LCSC Link; ComponentLink1URL: https://www.lcsc.com/product-detail/C44377.html?s_z=n_tps54360&spm=wm.ssy.bg.0.xh&lcsc_vid=FVcIBVBRElIPBFdUFgBYX10HEQJbUQVVQANfV1wFQQcxVlNRQ1RWV1ZTTlRdVzsOAxUeFF5JWBYZEEoKFBINSQcJGk4dAgUUFAk%3D
U16 = AMS1117: 1.2A Fixed 3.3V Positive 15V SOT-223 Voltage Regulators - Linear, Low Drop Out (LDO) Regulators ROHS
X1 = Crystal 5032 4P 8MhZ: Crystal 8MHz ±20ppm 12pF SMD5032-4P; Manufacturer: SOSET; Mfr. Part #: 5032 8M 12PF 20PPM 4P; LCSC Part #: C5181482; Package: SMD5032-4P; ComponentLink1Description: LCSC Link; ComponentLink1URL: https://www.lcsc.com/product-detail/C5181482.html?s_z=n_5032%25208m